# EAGLE design h_bridge_card (EAGLE 7.6.0)
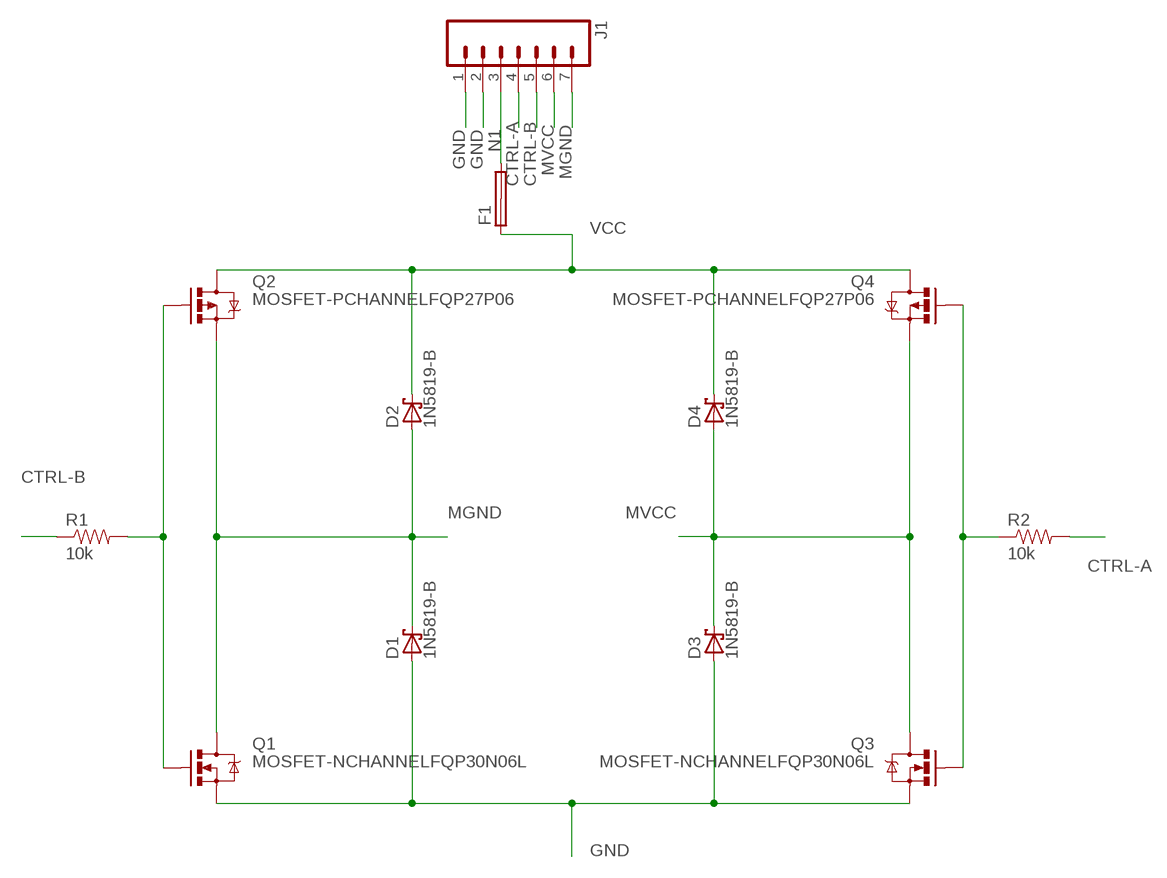
[diagram p0: schematic, sheet 1]

## Parts
D1  1N5819-B  [DO41-7.6]
D2  1N5819-B  [DO41-7.6]
D3  1N5819-B  [DO41-7.6]
D4  1N5819-B  [DO41-7.6]
F1  SHK20L  [SHK20L]
J1  M07LOCK  [1X07_LOCK]
Q1  MOSFET-NCHANNELFQP30N06L  [TO220V]
Q2  MOSFET-PCHANNELFQP27P06  [TO220V]
Q3  MOSFET-NCHANNELFQP30N06L  [TO220V]
Q4  MOSFET-PCHANNELFQP27P06  [TO220V]
R1  10k  10KOHM-1/4W5%(PTH)  [AXIAL-0.3]
R2  10k  10KOHM-1/4W5%(PTH)  [AXIAL-0.3]

## Nets
CTRL-A: J1.4 R2.P$2
CTRL-B: J1.5 R1.P$1
GND [PWR]: D1.A D3.A J1.1 J1.2 Q1.3(S) Q3.3(S)
MGND [PWR]: D1.C D2.A J1.7 Q1.2(D) Q2.3(S)
MVCC [PWR]: D3.C D4.A J1.6 Q3.2(D) Q4.3(S)
N1 [PWR]: F1.2A J1.3
N$3: Q3.1(G) Q4.1(G) R2.P$1
N$4: Q1.1(G) Q2.1(G) R1.P$2
VCC [PWR]: D2.C D4.C F1.1A Q2.2(D) Q4.2(D)
Unconnected: F1.1B F1.2B

## Library data of the parts
D1-D4 = diode:1N581*: 1.0A SCHOTTKY BARRIER RECTIFIER Source: http://www.diodes.com/datasheets/ds23001.pdf
F1 = fuse:SHK20L: FUSE HOLDER 5 x 20 mm, SH contact, SHH1 Schukat, E1073 Buerklin; OC_FARNELL: unknown; OC_NEWARK: unknown
J1 = SparkFun-Connectors:M07: Header 7 Standard 7-pin 0.1" header. Use with straight break away headers (SKU : PRT-00116), right angle break away headers (PRT-00553), swiss pins (PRT-00743), machine pins (PRT-00117), and female headers (PRT-00115). NOTES ON THE VARIANTS LOCK and LOCK_LONGPADS... This footprint was designed to help hold the alignment of a through-hole component (i.e. 7-pin header) while soldering it into place. You may notice that each hole has been shifted either up or down by 0.005 of an inch from it's more standard position (which is usually a perfectly straight line). This slight alteration caused the pins (the squares in the middle) to touch the edges of the holes. Because they are alternating, it causes a "brace" to hold the header in place. 0.005 has proven to be the perfect amount of "off-center" position when using our standard breakaway headers. Although looks a little odd when you look at the bare footprint, once you have a header in there, the alteration is very hard to notice. Also, if you push a header all the way into place, it is covered up entirely on the bottom side. This idea of altering the position of holes to aid alignment will be further integrated into the Sparkfun Library for other footprints. It can help hold any component with 3 or more connection pins.
Q1 Q3 = SparkFun-DiscreteSemi:MOSFET-NCHANNEL: Common NMOSFET Parts MFG P/N Store ID Prod ID FDD8780 TRANS-09984 SI7820DN TRANS-11055 FDS6630A IC-08089 2N7002PW TRANS-11151 FQP30N06L COM-10213 TRANS-10060 BSS123LT1G TRANS-08345 BSS138 TRANS-00830 BS170 2N7000; PROD_ID: TRANS-10060
Q2 Q4 = SparkFun-DiscreteSemi:MOSFET-PCHANNEL: Generic PMOSFET IRLML2244 - TRANS-11153 (SOT-23 -20V -4.3A) (1.Gate 2.Source 3.Drain) FQP27P06 - COM-10349 <http://www.sparkfun.com/products/10349> (TO-220 -60V -27A) (1.Gate 2.Source 3.Drain)
R1 R2 = SparkFun-Resistors:10KOHM-1/4W5%(PTH): RES-09435; PROD_ID: RES-9435

## Net classes
0 default: width 0.406 mm
1 PWR: width 0.762 mm

## Board
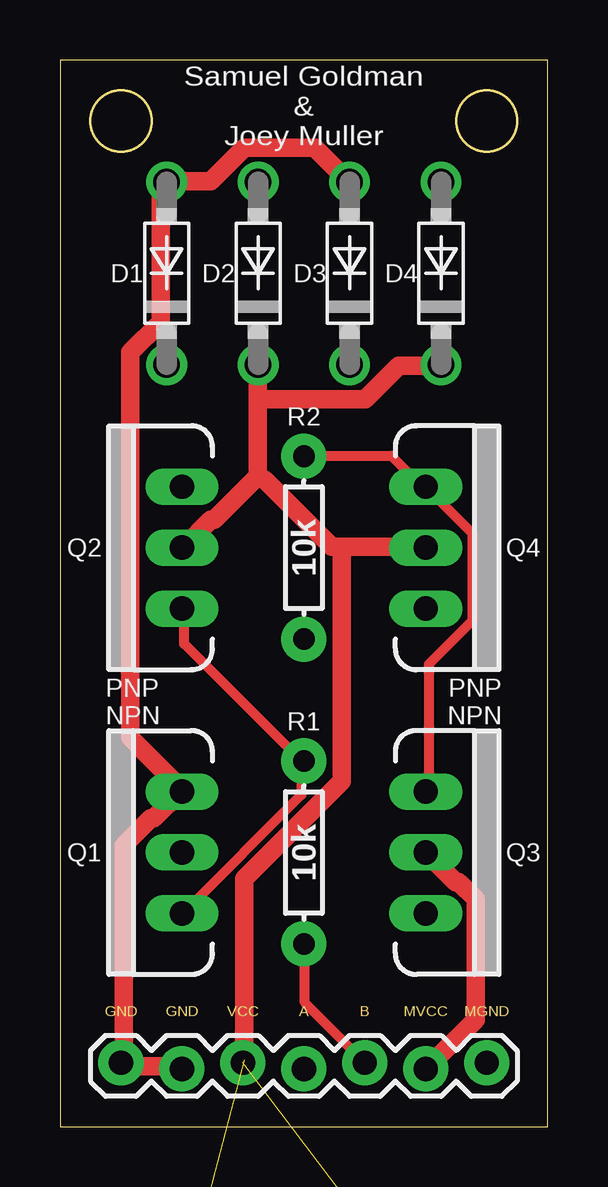
[diagram p1: board, top side]
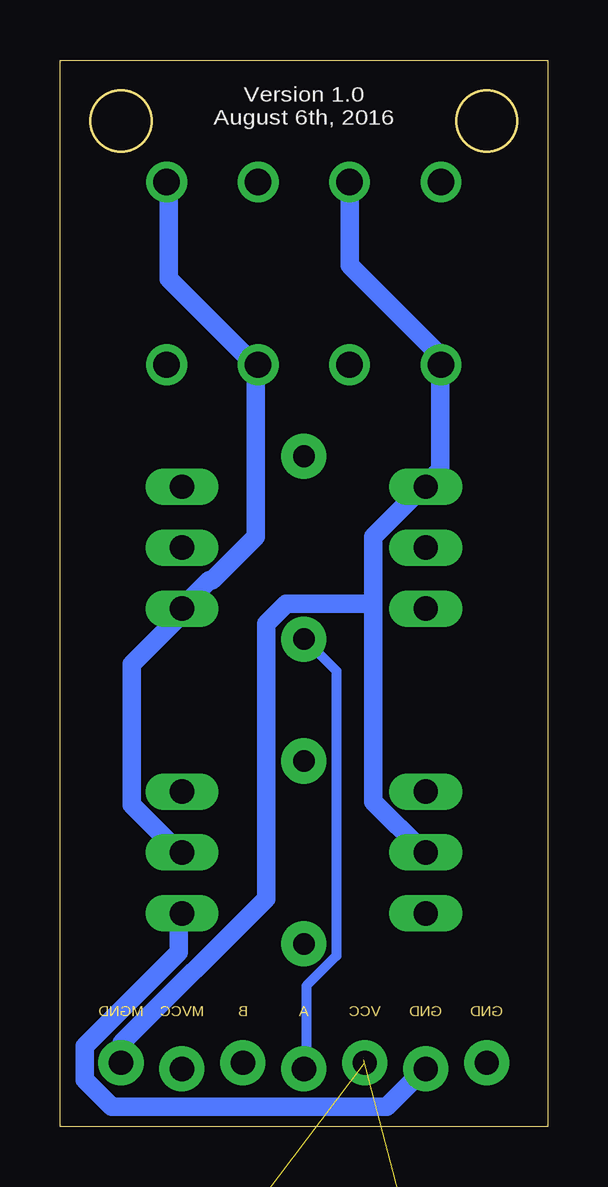
[diagram p2: board, bottom side, seen from below]

Size 20.32 x 44.45 mm. Coordinates in mm from the lower left corner, seen from the top.
Outline: 0,0 20.32,0 20.32,44.45 0,44.45 0,0
Outline: circle at 2.54,41.91 radius 1.27
Outline: circle at 17.78,41.91 radius 1.27
Copper layers (1*16): Top 0.0356mm / dielectric 1.5011mm / Bottom 0.0356mm
Design rules "oshpark-2layer": minimum track width 6mil, minimum drill 13mil, track to track 6mil, track to pad 6mil, pad to pad 6mil, via to via 6mil, smd to smd 6mil, copper to edge 15mil, drill to drill 6mil, minimum pad ring 7mil, minimum via ring 7mil, stop-mask expansion 2.5mil, vias tented up to drill 0mil, thermal gap 10mil

### Footprints (pad centres in the part's own frame; a part is rotated, then mirrored left to right if it is on the bottom)
DO41-7.6 = drill 1.1 pad 1.7: A 3.81,0; C -3.81,0
SHK20L = drill 1.321 pad 2.54 long: 1A -10.414,0; 1B -5.334,0; 2A 10.414,0; 2B 5.334,0
1X07_LOCK = drill 1.016 pad 1.88: 1 0,0.127; 2 2.54,-0.127; 3 5.08,0.127; 4 7.62,-0.127; 5 10.16,0.127; 6 12.7,-0.127; 7 15.24,0.127
TO220V = drill 1.016 long: 1 -2.54,0; 2 0,0; 3 2.54,0
AXIAL-0.3 = drill 0.9 pad 1.88: P$1 -3.81,0; P$2 3.81,0

### Placement (x,y rotation side)
D1  4.45,35.56 90 top
D2  8.26,35.56 90 top
D3  12.06,35.56 90 top
D4  15.88,35.56 90 top
F1  12.7,-17.78 0 top  (outside the outline)
J1  2.54,2.54 0 top
Q1  5.08,11.43 90 top
Q2  5.08,24.13 90 top
Q3  15.24,11.43 270 top
Q4  15.24,24.13 270 top
R1  10.16,11.43 90 top
R2  10.16,24.13 270 top

### Tracks (layer width: path | path; a pad name or v marks a point on that pad's centre or on a via)
CTRL-A
  Bottom 0.406: J1.4 10.06,2.52 10.06,5.87 8.8,7.12 8.8,19 10.06,20.26 R2.P$2
CTRL-B
  Top 0.406: J1.5 10.2,5.17 10.2,7.54 R1.P$1
GND
  Top 0.762: D3.A 12.01,39.4 10.62,40.79 7.68,40.79 6.29,39.4 4.47,39.4 D1.A 4.19,39.12 4.19,33.53 2.93,32.27 2.93,16.2 4.89,14.25 Q1.3 5.03,13.97 3.91,12.85 3.77,12.85 2.65,11.73 2.65,2.79 J1.1 2.79,2.52 5.03,2.52 J1.2
  Bottom 0.762: Q3.3 15.37,8.8 15.37,7.26 19.28,3.35 19.28,1.96 18.16,0.84 6.71,0.84 5.17,2.38 J1.2
MGND
  Bottom 0.762: 7.26,21.79 7.26,24.59 5.17,26.68 Q2.3 4.89,26.96 4.47,27.38 4.47,31.71 D1.C 4.47,32.13 8.24,35.9 8.24,39.26 D2.A | 7.26,21.79 7.26,13.55 5.17,11.46 Q1.2 | 7.26,21.79 10.9,21.79 11.73,20.95 11.73,9.5 17.74,3.49 17.74,2.79 J1.7
MVCC
  Top 0.762: Q3.2 15.37,11.32 16.48,10.2 16.62,10.2 17.32,9.5 17.32,4.47 15.37,2.52 J1.6
  Bottom 0.762: D4.A 15.79,39.26 15.79,35.34 12.43,31.99 D3.C 12.15,31.71 12.15,24.59 13.97,22.77 14.11,22.77 15.23,21.65 Q4.3 15.37,21.23 17.32,19.28 17.32,13.41 15.37,11.46 Q3.2
N1  (1 unrouted)
N$3
  Top 0.406: Q3.1 15.37,13.97 15.37,19.28 17.18,21.09 17.18,24.73 Q4.1 15.09,26.68 13.83,27.94 R2.P$1
N$4
  Top 0.406: Q1.1 5.17,8.94 10.06,13.83 10.06,15.23 R1.P$2 9.92,15.37 5.17,20.12 5.17,21.51 Q2.1
VCC  (1 unrouted)
  Top 0.762: 8.24,27.1 6.43,25.29 6.29,25.29 5.17,24.17 Q2.2 | 8.24,30.32 8.24,31.71 D2.C | 8.24,30.32 8.24,27.1 | 11.73,24.17 11.32,24.17 8.52,26.96 8.24,27.1 | 11.73,24.17 15.23,24.17 Q4.2 | 8.24,30.32 12.71,30.32 14.11,31.71 15.79,31.71 D4.C | 7.68,2.79 7.68,10.34 11.73,14.39 11.73,24.17

### Text on the board
Dimension: GND | GND | VCC | A | B | MVCC | MGND
tPlace: Samuel Goldman / & / Joey Muller | PNP / NPN | PNP / NPN
bPlace: Version 1.0 / August 6th, 2016